# Altium schematic sheet esp8266.SchDoc
size A
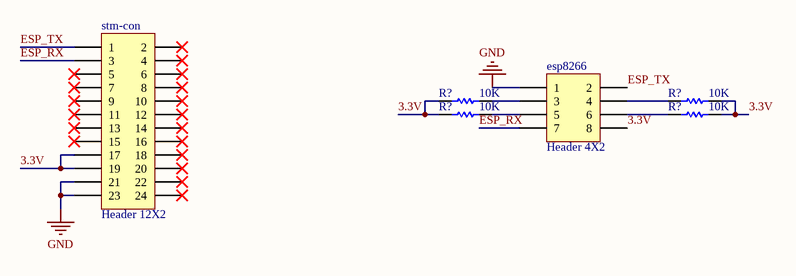
[diagram p0: esp8266.SchDoc]

## Parts
(Parts that share a designator on the sheet are numbered #1, #2 ... from top to bottom, then left to right.)
esp8266  Header 4X2  [HDR2X4]
R?#1  10K  [AXIAL-0.3]
R?#2  10K  [AXIAL-0.3]
R?#3  10K  [AXIAL-0.3]
R?#4  10K  [AXIAL-0.3]
stm-con  Header 12X2  [HDR2X12]

## Nets
GND: esp8266.1 stm-con.21 stm-con.23
3.3V: esp8266.8 R?#1.1 R?#2.2 R?#3.1 R?#4.2 stm-con.17 stm-con.19
ESP_RX: esp8266.7 stm-con.3
ESP_TX: esp8266.2 stm-con.1
Netesp8266_3: esp8266.3 R?#1.2
Netesp8266_4: esp8266.4 R?#2.1
Netesp8266_5: esp8266.5 R?#3.2
Netesp8266_6: esp8266.6 R?#4.1

Not connected (* = marked no-connect by the designer): stm-con 2* 4* 5* 6* 7* 8* 9* 10* 11* 12* 13* 14* 15* 16* 18* 20* 22* 24*

## Library data of the parts
esp8266 = Header 4X2: Header, 4-Pin, Dual row; LatestRevisionDate: 17-Jul-2002; LatestRevisionNote: Re-released for DXP Platform.; Publisher: Altium Limited
R?#1-R?#4 = Res1: Resistor; Value: 1K; Published: 8-Jun-2000; LatestRevisionDate: 17-Jul-2002; LatestRevisionNote: Re-released for DXP Platform.; PackageReference: AXIAL-0.3; Publisher: Altium Limited
stm-con = Header 12X2: Header, 12-Pin, Dual row; LatestRevisionDate: 17-Jul-2002; LatestRevisionNote: Re-released for DXP Platform.; Publisher: Altium Limited